# Altium schematic sheet Mirror TurnSignal - Connectors and Power supply.SchDoc
size A4
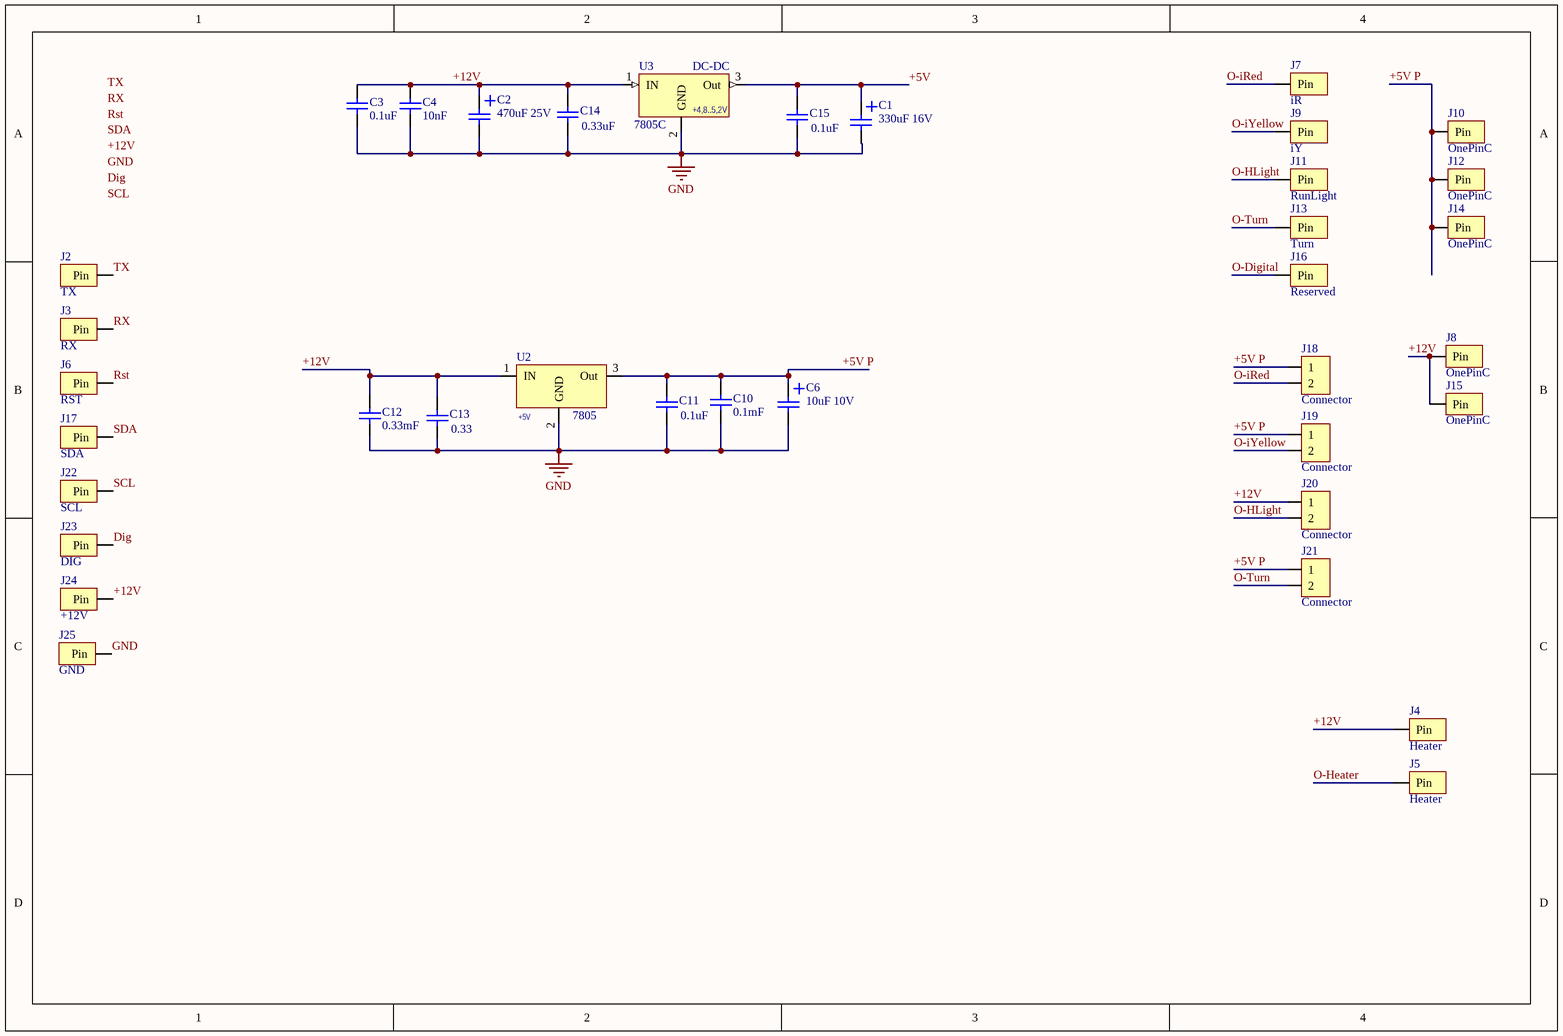
[diagram p0: Mirror TurnSignal - Connectors and Power supply.SchDoc]

## Parts
C1  330uF 16V  [Cap E p3.5mm D8xH12 R - PR]
C2  470uF 25V  [Cap E p2.54mm D4xH8 (2p)]
C3  0.1uF  [SMD 0805 (2012)]
C4  10nF  [SMD 0805 (2012)]
C6  10uF 10V  [Cap E p1.5mm D4xH8 (2p)]
C10  0.1mF  [Cap p2.54mm (2p)]
C11  0.1uF  [SMD 1206 (3216)]
C12  0.33mF  [Cap p2.54mm (2p)]
C13  0.33  [SMD 1206 (3216)]
C14  0.33uF  [SMD 1206 (3216)]
C15  0.1uF  [SMD 1206 (3216)]
J2  TX  [OnePin 0.7x2]
J3  RX  [OnePin 0.7x2]
J4  Heater  [OnePin 3x10mm Hole 0.7x8]
J5  Heater  [OnePin 3x10mm Hole 0.7x8]
J6  RST  [OnePin 0.7x2]
J7  iR  [OnePin 1.2x3]
J8  OnePinC  [OnePin 1.2x3]
J9  iY  [OnePin 1.2x3]
J10  OnePinC  [OnePin 1.2x3]
J11  RunLight  [OnePin 1.2x3]
J12  OnePinC  [OnePin 1.2x3]
J13  Turn  [OnePin 1.2x3]
J14  OnePinC  [OnePin 1.2x3]
J15  OnePinC  [OnePin 1.2x3]
J16  Reserved  [OnePin 1.2x3]
J17  SDA  [OnePin 0.7x2]
J18  Connector  [CWF-2]
J19  Connector  [CWF-2]
J20  Connector  [CWF-2]
J21  Connector  [CWF-2]
J22  SCL  [OnePin 0.7x2]
J23  DIG  [OnePin 0.7x2]
J24  +12V  [OnePin 0.7x2]
J25  GND  [OnePin 0.7x2]
U2  7805  V Out: +5V  [TO220 L]
U3  7805C  V Out: +4,8..5,2V  [D-PAK]

## Nets
GND: C1.2 C2.2 C3.2 C4.2 C6.2 C10.2 C11.2 C12.2 C13.2 C14.2 C15.2 J25.1(Pin) U2.2(GND) U3.2(GND)
+5V: C1.1 C15.1 U3.3(Out)
+5V P: C6.1 C10.1 C11.1 J10.1(Pin) J12.1(Pin) J14.1(Pin) J18.1 J19.1 J21.1 U2.3(Out)
+12V: C2.1 C3.1 C4.1 C12.1 C13.1 C14.1 J4.1(Pin) J8.1(Pin) J15.1(Pin) J20.1 J24.1(Pin) U2.1(IN) U3.1(IN)
Dig: J23.1(Pin)
O-Digital: J16.1(Pin)
O-Heater: J5.1(Pin)
O-HLight: J11.1(Pin) J20.2
O-iRed: J7.1(Pin) J18.2
O-iYellow: J9.1(Pin) J19.2
O-Turn: J13.1(Pin) J21.2
Rst: J6.1(Pin)
RX: J3.1(Pin)
SCL: J22.1(Pin)
SDA: J17.1(Pin)
TX: J2.1(Pin)

## Notes on the sheet
- (near U3) DC-DC
- Labels drawn without touching a wire or pin: +12V, Dig, GND, Rst, RX, SCL, SDA, TX

## Library data of the parts
C1 C2 C6 = Cap Elecrolitic: Capacitor
C3 C4 C11 C13-C15 = Cap SMD 0402-1812: Capacitor
C10 C12 = Cap Ceramic: Capacitor
J2-J17 J22-J25 = OnePin Connector: Only pad
J18-J21 = CWF-2 (R): CWF series
U2 = KPEH: Linear Voltage Regulator; t: 0...+150°C; Case: TO220; Name: Linear Voltage Regulator
U3 = 7805C: Voltage Regulator; Manufacturer: Интеграл; I output (A): 1; Max Voltage In (V): 35; Напряжение выход-вход (dropout): >2V; t: -10..+70°C; Case: D2PAK; Shema: http://tec.org.ru/_bd/5/57349922.jpg; Name: 7805C